# EAGLE design HydraLinCan (EAGLE 9.6.2)
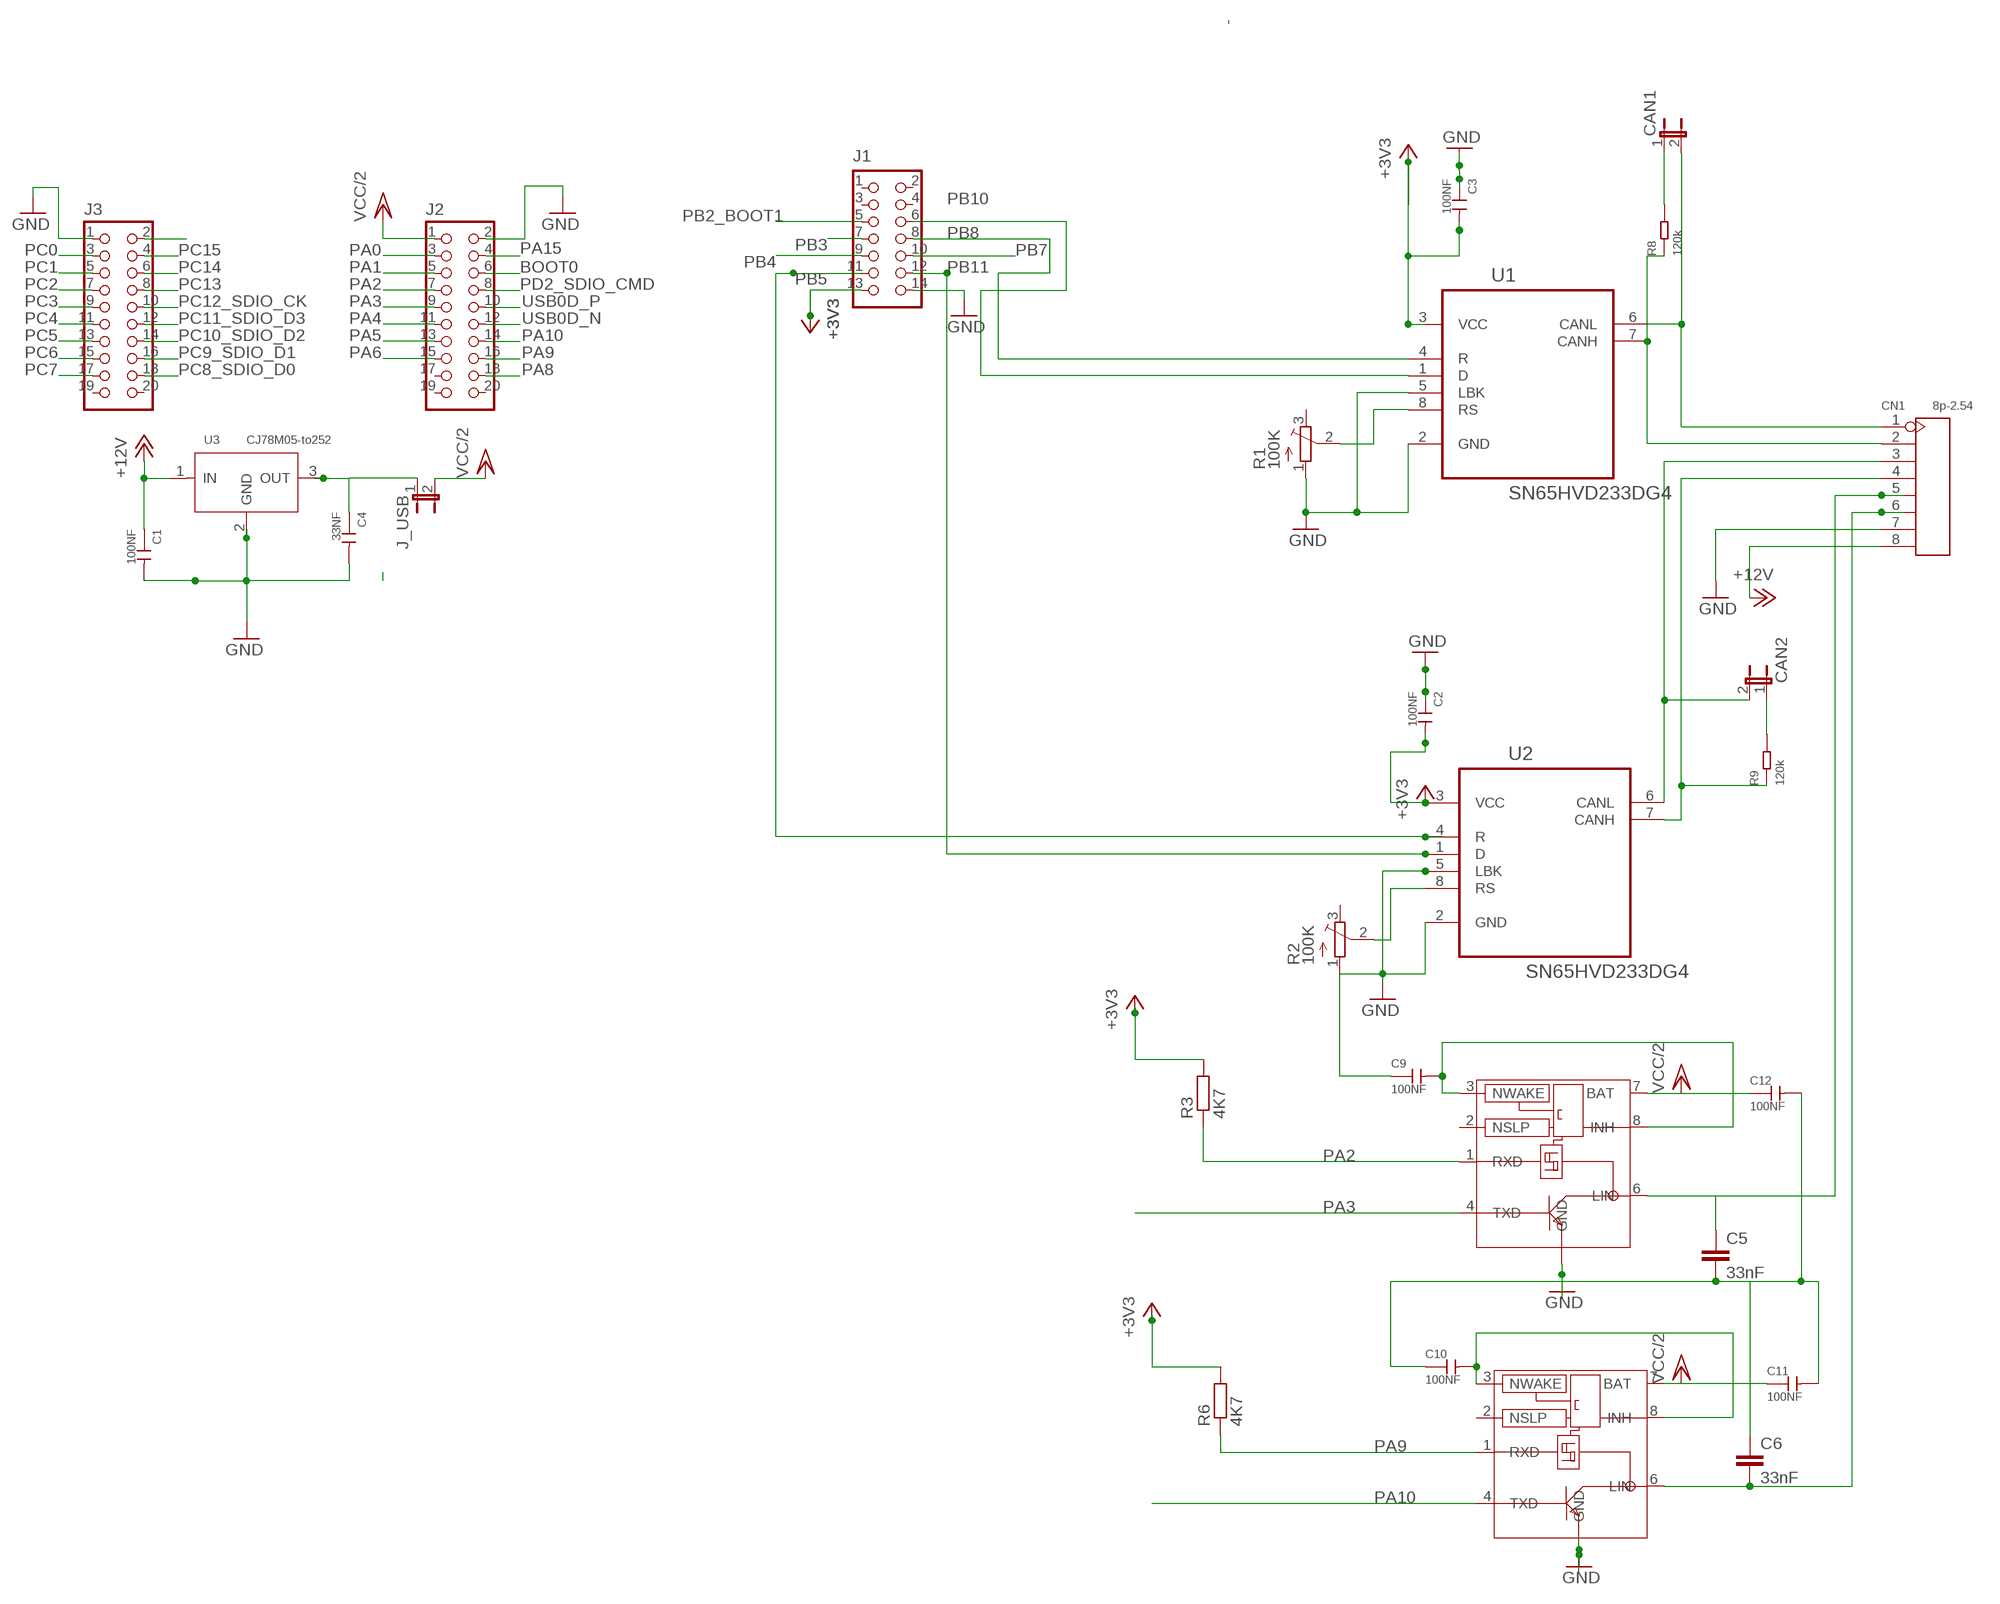
[diagram p0: schematic, sheet 1]

## Parts
C1  100NF  CERAMIC-100NF-50V-20%-Y5V(0805)  [C0805]
C2  100NF  CERAMIC-100NF-50V-20%-Y5V(0805)  [C0805]
C3  100NF  CERAMIC-100NF-50V-20%-Y5V(0805)  [C0805]
C4  33NF  CERAMIC-100NF-50V-20%-Y5V(0805)  [C0805]
C5  33nF  CAP1206  [1206]
C6  33nF  CAP1206  [1206]
C9  100NF  CERAMIC-100NF-50V-20%-Y5V(0805)  [C0805]
C10  100NF  CERAMIC-100NF-50V-20%-Y5V(0805)  [C0805]
C11  100NF  CERAMIC-100NF-50V-20%-Y5V(0805)  [C0805]
C12  100NF  CERAMIC-100NF-50V-20%-Y5V(0805)  [C0805]
CAN1  JP1E  [JP1]
CAN2  JP1E  [JP1]
CN1  8p-2.54  DIP-BLACK-FEMALE-HEADER-VERT(8P-2.54)  [H8-2.54]
J1  HYDRABUS_SHIELD_CON_HEADER_2X07  [HYDRABUS_SHIELD_M2X7]
J2  HYDRABUS_SHIELD_CON_HEADER_2X10  [HYDRABUS_SHIELD_M2X10]
J3  HYDRABUS_SHIELD_CON_HEADER_2X10  [HYDRABUS_SHIELD_M2X10]
J_USB  JP1E  [JP1]
LIN1  TJA1021SO8  TJA1020SO8  [SO8]
LIN2  TJA1021SO8  TJA1020SO8  [SO8]
R1  100K  TRIM_EU-SM-42/43A  [SM-42/43A]
R2  100K  TRIM_EU-SM-42/43A  [SM-42/43A]
R3  4K7  R-EU_M1206  [M1206]
R6  4K7  R-EU_M1206  [M1206]
R8  120k  SMD-RES-33K-1%-1/4W(1206)  [R1206]
R9  120k  SMD-RES-33K-1%-1/4W(1206)  [R1206]
U1  SN65HVD233DG4  [SOIC127P600X175-8N]
U2  SN65HVD233DG4  [SOIC127P600X175-8N]
U3  CJ78M05-to252  PMIC-CJ78M05(TO-252)  [TO-252]

## Nets
+3V3 [VDD]: C2.2 C3.2 J1.13 R3.2 R6.2 U1.3(VCC) U2.3(VCC)
+12V [VDD]: C1.1 CN1.8 U3.1(IN)
BOOT0: J2.6
CAN1_N [CAN1]: CAN1.2 CN1.1 U1.6(CANL)
CAN1_P [CAN1]: CN1.2 R8.1 U1.7(CANH)
CAN2_N [CAN]: CAN2.2 CN1.3 U2.6(CANL)
CAN2_P [CAN]: CN1.4 R9.1 U2.7(CANH)
GND [VDD]: C1.2 C2.1 C3.1 C4.2 C5.2 C6.1 C10.1 C11.2 C12.2 CN1.7 J1.14 J2.2 J3.1 LIN1.5(GND) LIN2.5(GND) R1.1(A) U1.2(GND) U1.5(LBK) U2.5(LBK) U3.2(GND)
N$1: R1.2(S) U1.8(RS)
N$4: C5.1 CN1.5 LIN1.6(LIN)
N$7: C6.2 CN1.6 LIN2.6(LIN)
N$9 [VDD]: C9.2 LIN1.3(NWAKE) LIN1.8(INH)
N$10 [VDD]: C10.2 LIN2.3(NWAKE) LIN2.8(INH)
N$13: C9.1 R2.1(A) U2.2(GND)
N$15 [VDD]: C4.1 J_USB.1 U3.3(OUT)
N$16: CAN2.1 R9.2
N$17: R2.2(S) U2.8(RS)
N$19: CAN1.1 R8.2
N$22 [POWER]: J3.2
PA0: J2.3
PA1: J2.5
PA2: J2.7 LIN1.1(RXD) R3.1
PA3: J2.9 LIN1.4(TXD)
PA4: J2.11
PA5: J2.13
PA6: J2.15
PA8: J2.18
PA9: J2.16 LIN2.1(RXD) R6.1
PA10: J2.14 LIN2.4(TXD)
PA15: J2.4
PB2_BOOT1: J1.5
PB3: J1.7
PB4: J1.9
PB5: J1.11 U2.4(R)
PB7: J1.10
PB8: J1.8 U1.4(R)
PB10: J1.6 U1.1(D)
PB11: J1.12 U2.1(D)
PC0: J3.3
PC1: J3.5
PC2: J3.7
PC3: J3.9
PC4: J3.11
PC5: J3.13
PC6: J3.15
PC7: J3.17
PC8_SDIO_D0: J3.18
PC9_SDIO_D1: J3.16
PC10_SDIO_D2: J3.14
PC11_SDIO_D3: J3.12
PC12_SDIO_CK: J3.10
PC13: J3.8
PC14: J3.6
PC15: J3.4
PD2_SDIO_CMD: J2.8
USB0D_N: J2.12
USB0D_P: J2.10
VCC/2 [VDD]: C11.1 C12.1 J2.1 J_USB.2 LIN1.7(BAT) LIN2.7(BAT)
Unconnected: J1.1 J1.2 J1.3 J1.4 J2.17 J2.19 J2.20 J3.19 J3.20 LIN1.2(NSLP) LIN2.2(NSLP) R1.3(E) R2.3(E)

## Library data of the parts
C1-C3 C9-C12 = Seeed-OPL-Capacitor:CERAMIC-100NF-50V-20%-Y5V(0805): 302010145
C4 = Seeed-OPL-Capacitor:CERAMIC-100NF-50V-20%-Y5V(0805): 302010145; VALUE: 100NF
C5 C6 = _c2h:CAP: Capacitor Standard 0603 ceramic capacitor, and 0.1" leaded capacitor.
CAN1 CAN2 J_USB = jumper:JP1E: JUMPER
CN1 = Seeed-OPL-Connector:DIP-BLACK-FEMALE-HEADER-VERT(8P-2.54): 320030061; MPN: F185-1108A1BSYC1
J1 = hydrabus_shield:HYDRABUS_SHIELD_CON_HEADER_2X07: 2x7 Pin header
J2 J3 = hydrabus_shield:HYDRABUS_SHIELD_CON_HEADER_2X10: 2x10 Pin header
LIN1 LIN2 = nxp:TJA1020: Lin Transiver Vbat 5...27Volt 3,3Volt support no extra supply needed ->www.lin-subbus.org ->www.semiconductor.philips.com/pip/tja1020t
R1 R2 = pot:TRIM_EU-: POTENTIOMETER
R3 R6 = resistor:R-EU_: RESISTOR, European symbol
R8 R9 = Seeed-OPL-Resistor:SMD-RES-33K-1%-1/4W(1206): 301010725; MPN: RC1206FR-0733KL; VALUE: 33k
U1 U2 = Texas Instruments_By_element14_Batch_1:SN65HVD233DG4: CAN TRANSCEIVERS; MPN: SN65HVD233DG4; OC_FARNELL: 1207268; OC_NEWARK: 16M2304; PACKAGE: SOIC-8; SUPPLIER: TI
U3 = Seeed-OPL-ic:PMIC-CJ78M05(TO-252): 310030100; MPN: CJ78M05

## Net classes
0 default: width 0.254 mm, drill 0.33 mm, clearance 0.203 mm
1 POWER: width 0.33 mm, drill 0.33 mm, clearance 0.203 mm
2 VDD: width 0.33 mm, drill 0.33 mm, clearance 0.203 mm
3 CAN: width 0.33 mm, drill 0.33 mm, clearance 0.203 mm
4 CAN1: width 0.33 mm, drill 0.33 mm, clearance 0.203 mm

## Board
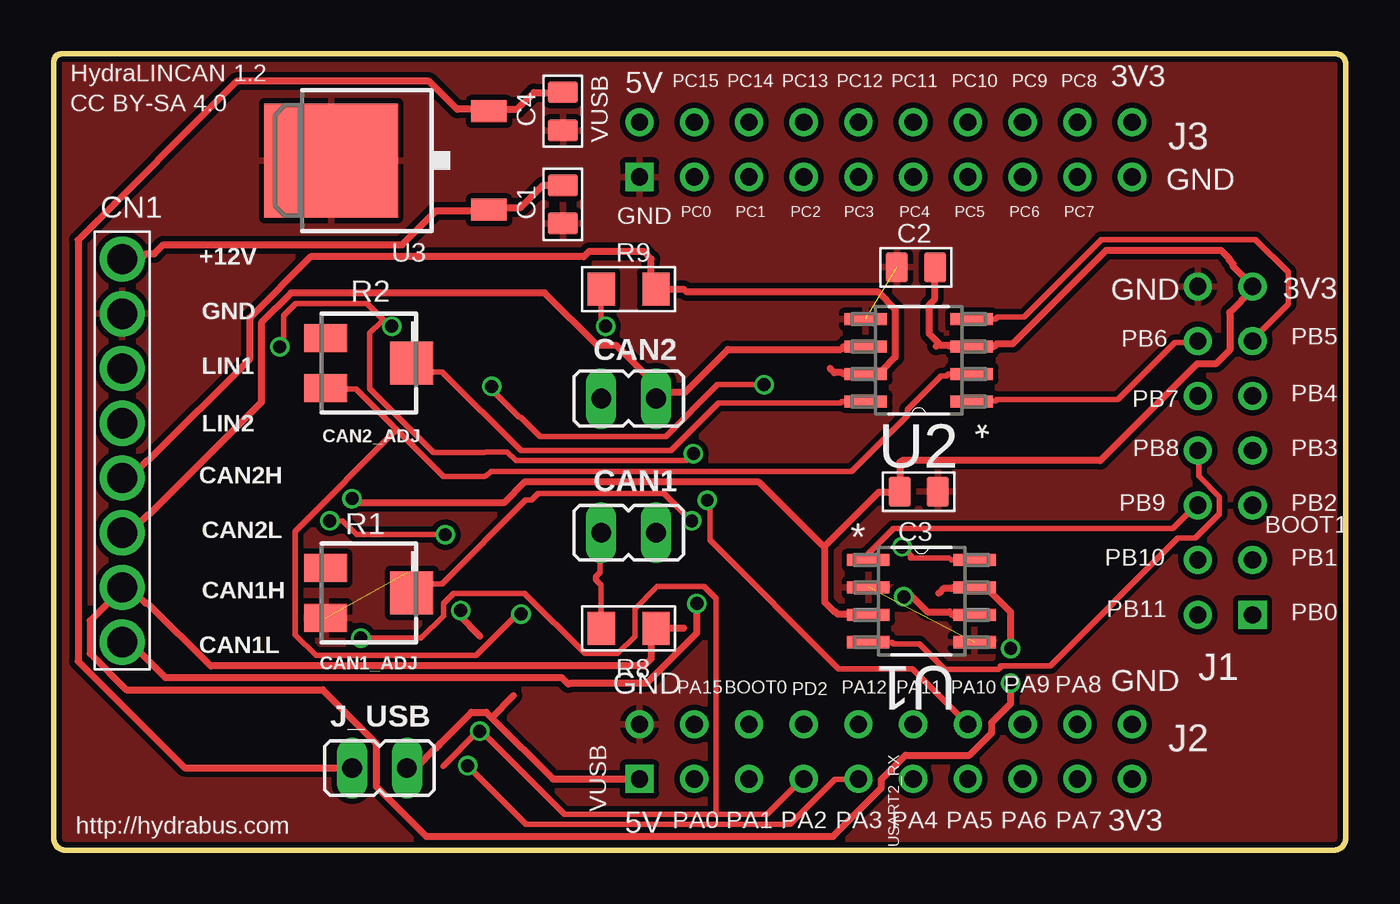
[diagram p1: board, top side]
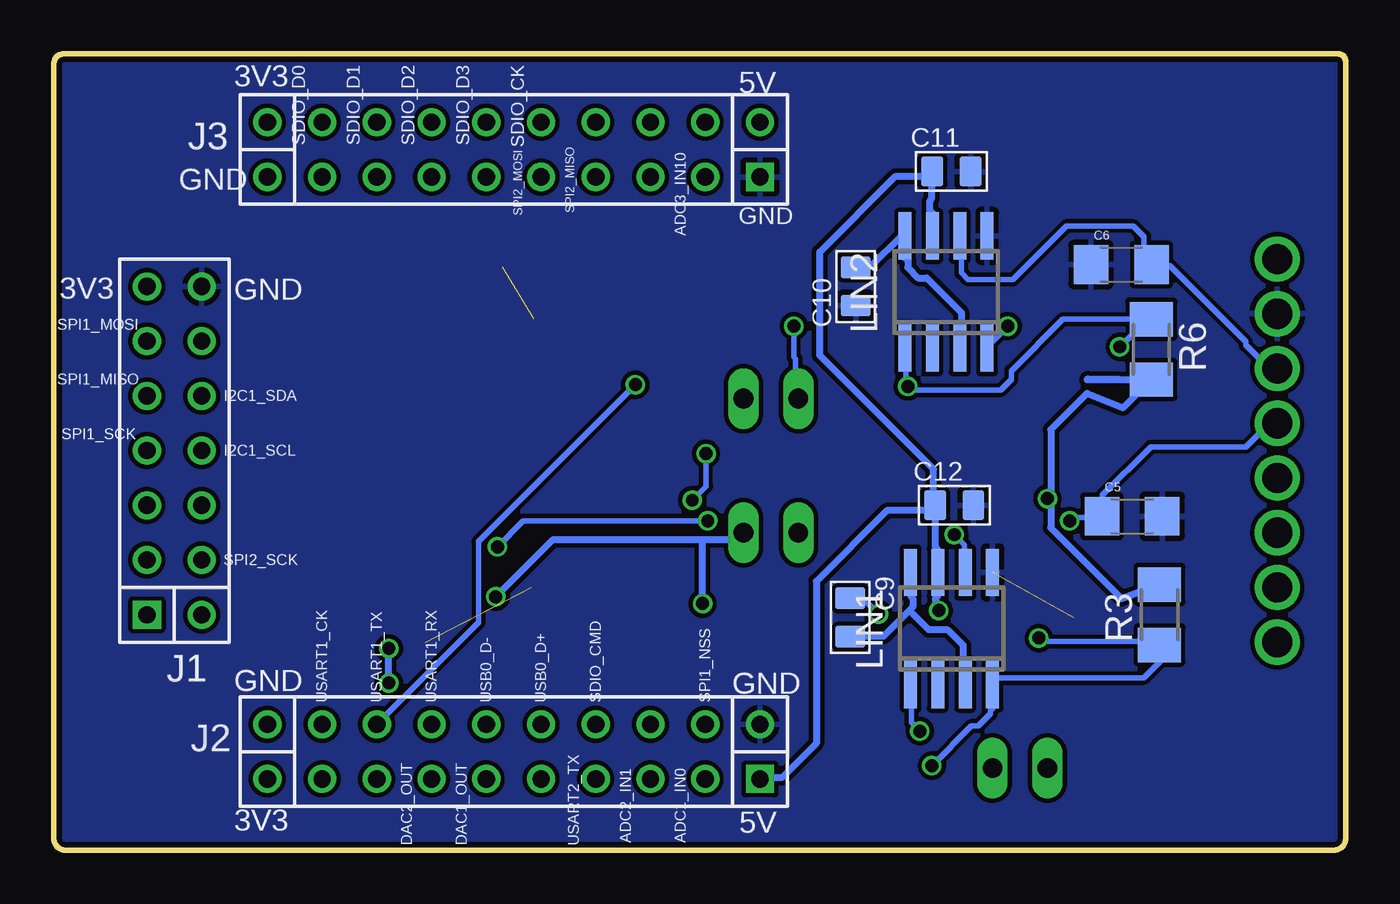
[diagram p2: board, bottom side, seen from below]

Size 59.94 x 36.96 mm. Coordinates in mm from the lower left corner, seen from the top.
Outline: 59.41,0 0.52,0 arc-90 0,0.52 0,36.6 arc-90 0.36,36.96 59.49,36.96 arc-90 59.94,36.5 59.94,0.54 arc-90 59.41,0
Copper layers (1*16): Top 0.035mm / dielectric 1.5mm / Bottom 0.035mm
Design rules "SeeedStudio_2layer_DRU_no_angle_20140221 *": minimum track width 6mil, minimum drill 0.6mm, track to track 6mil, track to pad 6mil, pad to pad 6mil, via to via 6mil, smd to smd 0mil, copper to edge 10mil, drill to drill 10mil, minimum pad ring 10mil, minimum via ring 6mil, stop-mask expansion 2mil, vias tented up to drill 100mil, thermal gap 10mil

### Footprints (pad centres in the part's own frame; a part is rotated, then mirrored left to right if it is on the bottom)
C0805 = smd 1.397 x 1.016: 1 0,0.889; 2 0,-0.889
1206 = smd 1.6 x 1.8: 1 -1.4,0; 2 1.4,0
JP1 = drill 0.914 long: 1 0,-1.27; 2 0,1.27
H8-2.54 = drill 1.4 pad 1.93: 1 0,8.89; 2 0,6.35; 3 0,3.81; 4 0,1.27; 5 0,-1.27; 6 0,-3.81; 7 0,-6.35; 8 0,-8.89
HYDRABUS_SHIELD_M2X7 = drill 0.8 square: 1 -7.62,-1.27 | drill 0.8: 2 -7.62,1.27; 3 -5.08,-1.27; 4 -5.08,1.27; 5 -2.54,-1.27; 6 -2.54,1.27; 7 0,-1.27; 8 0,1.27; 9 2.54,-1.27; 10 2.54,1.27; 11 5.08,-1.27; 12 5.08,1.27; 13 7.62,-1.27; 14 7.62,1.27
HYDRABUS_SHIELD_M2X10 = drill 0.8 square: 1 -11.43,-1.27 | drill 0.8: 2 -11.43,1.27; 3 -8.89,-1.27; 4 -8.89,1.27; 5 -6.35,-1.27; 6 -6.35,1.27; 7 -3.81,-1.27; 8 -3.81,1.27; 9 -1.27,-1.27; 10 -1.27,1.27; 11 1.27,-1.27; 12 1.27,1.27; 13 3.81,-1.27; 14 3.81,1.27; 15 6.35,-1.27; 16 6.35,1.27; 17 8.89,-1.27; 18 8.89,1.27; 19 11.43,-1.27; 20 11.43,1.27
SO8 = smd 0.6 x 2.2: 1 -1.905,-2.6; 2 -0.635,-2.6; 3 0.635,-2.6; 4 1.905,-2.6; 5 1.905,2.6; 6 0.635,2.6; 7 -0.635,2.6; 8 -1.905,2.6
SM-42/43A = smd 2 x 1.3: 1 2,1.15; 3 2,-1.15 | smd 2 x 2: 2 -2,0
M1206 = smd 1.6 x 2: 1 -1.4,0; 2 1.4,0
R1206 = smd 1.27 x 1.524: 1 -1.27,0; 2 1.27,0
SOIC127P600X175-8N = smd 1.981 x 0.559: 1 -2.464,1.905; 2 -2.464,0.635; 3 -2.464,-0.635; 4 -2.464,-1.905; 5 2.464,-1.905; 6 2.464,-0.635; 7 2.464,0.635; 8 2.464,1.905
TO-252 = smd 1.016 x 1.651: 1 -2.286,-4.826; 3 2.286,-4.826 | smd 5.3 x 6.2: 2 0,2.5

### Placement (x,y rotation side)
C1  23.62,29.97 0 top
C2  40.01,27.05 90 top
C3  40.13,16.64 270 top
C4  23.62,34.29 0 top
C5  9.91,15.49 0 bottom
C6  10.41,27.18 0 bottom
C9  22.99,10.79 0 bottom
C10  22.73,26.16 180 bottom
C11  18.29,31.5 90 bottom
C12  18.16,16 90 bottom
CAN1  26.67,14.73 270 top
CAN2  26.67,20.95 270 top
CN1  3.17,18.54 180 top
J1  54.36,18.54 90 top
J2  38.61,4.57 0 top
J3  38.61,32.51 0 top
J_USB  15.11,3.81 270 top
LIN1  18.29,10.29 0 bottom
LIN2  18.54,25.91 0 bottom
R1  14.61,11.94 180 top
R2  14.61,22.61 180 top
R3  8.64,10.92 90 bottom
R6  9.02,23.24 270 bottom
R8  26.67,10.29 180 top
R9  26.67,26.04 180 top
U1  40.26,11.56 0 top
U2  40.13,22.73 180 top
U3  15.37,32 90 top

### Tracks (layer width: path | path; a pad name or v marks a point on that pad's centre or on a via)
+3V3  (via drill 0.6)
  Top 0.33: 35.78,14.12 38.28,16.62 39.24,16.62 C3.2 39.26,16.8 39.26,18 39.36,18.08 48.56,18.08 53.04,22.56 53.92,22.56 54.56,23.2 54.56,24.96 55.6,26 J1.13 55.62,26.18 55.3,26.5 55.3,26.52 54.72,27.1 54.72,27.22 54.54,27.4 54.54,27.46 54.16,27.84 48.84,27.84 44.5,23.5 43.76,23.5 43.64,23.38 42.76,23.38 U2.3 42.58,23.38 41.58,23.38 41.54,23.42 41.16,23.42 41.07,23.51 | 35.78,14.12 35.78,11.5 36.22,11.06 36.26,11.06 36.38,10.94 37.78,10.94 U1.3 | 41.07,23.51 40.62,23.96 40.62,25.32 40.88,25.58 C2.2 | 40.94,23.38 41.07,23.51 | 35.78,14.12 35.62,14.18 32.72,17.08 21.84,17.08 20.88,16.12 13.78,16.12 13.68,16.24 13.76,16.32 v13.84,16.32
  Bottom 0.33: 8.4,12.48 8.54,12.42 R3.2 10.4,11.68 13.68,14.96 13.68,16.32 | 9.04,21.84 12,21.84 11.95,21.89 R6.2 10.33,20.53 12,21.2 13.68,19.52 13.68,16.32 | v13.84,16.32 13.68,16.32
+12V
  Top 0.33: C1.1 22.7,30.86 21.66,29.82 20.3,29.82 U3.1 20.04,29.68 17.74,29.68 16.16,28.1 5.08,28.1 4.66,27.68 4.28,27.68 4.04,27.44 CN1.8
CAN1_N  (via drill 0.6)
  Top 0.33: U1.6 41.7,10.92 41.56,11.06 40.54,11.06 39.78,11.82 39.68,11.76 v39.44,11.76 | CN1.1 3.54,9.64 5.18,8 23.58,8 23.88,7.7 24,7.76 27.52,7.76 29.84,10.08 v29.84,11.44
  Bottom 0.33: v39.44,11.76 36.8,14.4 29.84,14.4 | 29.84,14.4 28.32,14.4 28,14.72 CAN1.2 | v29.84,11.44 29.84,14.4
CAN1_P  (via drill 0.6)
  Top 0.33: 29.24,10.3 R8.1 27.86,10.14 27.72,10 27.72,8.88 27.38,8.54 7.28,8.54 4.36,11.46 4.26,11.46 3.54,12.18 CN1.2 3.12,12.08 1.68,10.64 1.68,9.12 3.36,7.44 12.48,7.44 14.96,4.96 14.96,2.96 17.28,0.64 36.16,0.64 38.4,2.88 38.4,3.28 39.52,4.4 42.48,4.4 43.52,5.44 43.52,5.92 44.4,6.8 v44.4,7.76 | 41.06,11.92 41.28,12.14 41.66,12.14 41.7,12.18 U1.7 42.88,12.16 43.28,12.16 44.4,11.04 v44.4,9.36
  Bottom 0.33: v44.4,7.76 v44.4,9.36
CAN2_N
  Top 0.33: U2.6 36.64,23.36 36.52,23.24 31.28,23.24 29.3,21.26 28.24,21.26 CAN2.2 28.14,21.38 26.1,23.42 25.22,23.42 22.78,25.86 11,25.86 9.62,24.48 9.62,20.78 4.4,15.56 4.36,15.56 3.54,14.74 CN1.3
CAN2_P
  Top 0.33: 36.02,22.36 36.22,22.16 36.58,22.16 36.64,22.1 U2.7 37.76,22.24 38.4,22.24 39.04,22.88 39.04,25.12 38.24,25.92 29.36,25.92 29.24,26.02 27.94,26.02 R9.1 27.88,26.2 27.72,26.36 27.72,27.44 27.38,27.78 24.84,27.78 24.6,27.54 11.92,27.54 9.08,24.7 9.08,22.78 4.4,18.1 4.36,18.1 3.54,17.28 CN1.4
GND  (3 unrouted)
  pour Top (isolate 0.254): -1,38.22 60.84,38.22 60.84,-1 -1,-1
  pour Bottom (isolate 0.203): -2.02,39.86 62.13,39.86 62,-2 -2,-2
N$1  (via drill 0.6)
  Top 0.254: 39.74,13.56 39.76,13.56 | 39.76,13.56 41.54,13.56 41.64,13.46 U1.8 | R1.2 17.04,12.36 18.02,12.36 21.9,16.24 22.18,16.24 22.24,16.32 22.48,16.56 28.32,16.56 v29.6,15.28 | v39.36,14.08 39.76,13.68 39.76,13.56
  Bottom 0.254: v39.36,14.08 38.16,15.28 v29.6,15.28
N$4  (via drill 0.6)
  Top 0.254: v18.16,14.64 14.04,14.64 13.4,15.28 v12.8,15.28 12.78,15.28
  Bottom 0.254: v12.8,15.28 12.64,15.44 11.36,15.44 C5.1 11.28,15.6 11.28,16.48 9.04,18.72 4.64,18.72 3.6,19.76 3.2,19.76 CN1.5 | v18.16,14.64 17.68,14.16 17.68,12.96 LIN1.6
N$7
  Bottom 0.254: CN1.6 3.2,22.4 3.6,22.4 4.64,23.44 4.64,23.6 8.16,27.12 8.96,27.12 C6.2 9.04,27.28 9.36,27.6 9.36,28.48 9.84,28.96 12.96,28.96 15.44,26.48 17.52,26.48 17.84,26.8 17.84,28.48 LIN2.6
N$9
  Bottom 0.33: 20.24,11.12 20.08,11.28 20.08,11.68 20.16,11.76 20.16,12.88 LIN1.8 | 20.24,11.12 21.44,9.92 22.96,9.92 C9.2 | 20.24,11.12 19.36,10.24 18.48,10.24 17.76,9.52 17.76,8.96 17.68,8.88 17.68,7.76 LIN1.3
N$10
  Bottom 0.33: C10.2 22.72,27.12 22,27.12 20.64,28.48 20.48,28.48 LIN2.8 20.48,28.32 20.48,27.52 20.32,27.36 20.32,27.04 19.84,26.56 19.44,26.56 17.84,24.96 17.84,23.36 LIN2.3
N$13  (via drill 0.6)
  Top 0.254: 15.91,19.51 14.02,21.4 12.66,21.4 12.62,21.44 R2.1 | 15.91,19.51 18.08,17.34 19.96,17.34 20.08,17.38 20.28,17.58 37.02,17.58 39.6,20.16 39.6,20.44 41.16,22 41.42,22 41.52,22.1 42.58,22.1 U2.2 | v21.68,10.96 21.52,10.96 19.6,9.04 12.16,9.04 11.2,10 11.2,14.8 15.91,19.51
  Bottom 0.254: v21.68,10.96 22.4,11.68 22.96,11.68 C9.1
N$15
  Top 0.33: C4.1 23.62,35.16 22.28,35.16 21.5,34.38 20.28,34.38 U3.3 20.06,34.38 18.72,34.38 17.42,35.68 8.48,35.68 1.12,28.32 1.12,8.76 6.06,3.82 J_USB.1
N$16  (via drill 0.6)
  Top 0.254: R9.2 25.4,24.6 25.44,24.48 v25.6,24.32
  Bottom 0.254: v25.6,24.32 25.6,22.88 25.52,22.8 25.52,21.04 25.44,20.96 CAN2.1
N$17
  Top 0.254: U2.8 36.58,20.82 36.5,20.74 30.84,20.74 28.64,18.54 21.68,18.54 18.02,22.2 17.02,22.2 R2.2
N$19
  Top 0.254: R8.2 25.4,12.3 25.14,12.56 25.14,12.68 25.34,12.88 25.34,13.36 25.4,13.42 CAN1.1
PA2  (via drill 0.6)
  Top 0.254: 19.72,5.56 18.06,3.9 | 30.72,1.66 23.7,1.66 19.84,5.52 19.72,5.56 | 30.72,1.66 33.1,1.66 34.74,3.3 34.78,3.3 J2.7 | v14.24,9.84 17.04,9.84 18.08,10.88 18.08,11.44 18.56,11.92 21.84,11.92 24.64,9.12 26.16,9.12 26.96,9.92 26.96,11.2 28,12.24 30.16,12.24 30.72,11.68 30.72,1.66 | v19.76,5.52 19.72,5.56
  Bottom 0.254: v14.24,9.84 14.08,9.68 8.69,9.68 R3.1 | v19.76,5.52 20.16,5.92 20.16,7.68 LIN1.1
PA3  (via drill 0.6)
  Top 0.254: v19.2,3.92 21.92,1.2 34.16,1.2 36.24,3.28 37.28,3.28 J2.9
  Bottom 0.254: 8.4,9.6 8.4,8.96 9.36,8 16.16,8 16.4,7.76 LIN1.4 16.32,7.6 16.32,6.64 16.48,6.48 16.48,6.32 17.04,5.76 17.36,5.76 v19.2,3.92
PA9  (via drill 0.6)
  Top 0.254: 20.14,21.54 20.24,21.44 | 20.24,21.44 21.58,20.1 21.68,20.08 22.56,19.2 28.4,19.2 30.8,21.6 v32.96,21.6 | v20.32,21.52 20.24,21.44
  Bottom 0.254: LIN2.1 20.4,23.28 20.4,21.6 v20.32,21.52 20.16,21.36 16,21.36 15.52,21.84 15.52,22.24 13.12,24.64 9.03,24.64 R6.1 | J2.16 40.24,10.56 40.24,14.32 v32.96,21.6
PA10  (via drill 0.6)
  Top 0.254: v10.49,23.35 10.66,23.52 10.66,24.8 11.22,25.36 14.54,25.36 15.34,24.56 | v10.49,23.35 10.46,23.32 | J2.14 39.84,8.42 36.42,8.42 30.44,14.4 30.44,16.24 v30.32,16.24 | 15.34,24.56 15.2,24.54 14.66,24 14.66,21.42 17.62,18.46 19.96,18.46 20.08,18.48 21.04,18.48 21.44,18.08 29.36,18.08 v29.68,18.4 | v10.48,23.36 v10.49,23.35 | v15.68,24.32 15.44,24.56 15.34,24.56
  Bottom 0.254: 9.04,24.64 9.2,24.64 v10.48,23.36 | v15.68,24.32 16.56,23.44 16.56,23.36 LIN2.4 | v29.68,18.4 29.68,16.88 v30.32,16.24
PB5
  Top 0.254: U2.4 43.68,24.64 43.78,24.74 45.02,24.74 48.62,28.34 55.76,28.34 57.28,26.82 57.28,25.34 55.64,23.7 55.64,23.64 J1.11
PB8
  Top 0.254: U1.4 38.88,9.64 38.96,9.56 40.16,9.56 41.34,8.38 43.84,8.38 43.92,8.46 43.92,8.56 46.24,8.56 52.16,14.48 52.96,14.48 54.08,15.6 54.08,16.4 53.12,17.36 53.12,18.48 J1.8
PB10
  Top 0.254: U1.1 37.8,13.48 37.8,13.76 38.96,14.92 51.92,14.92 53,16 J1.6
PB11
  Top 0.254: U2.1 43.68,20.84 43.76,20.92 49.38,20.92 52.02,23.56 53.02,23.56 J1.12
VCC/2  (via drill 0.6)
  Top 0.33: 20.31,6.15 20.06,6.4 19.38,6.4 17.92,4.94 17.92,4.92 17.74,4.74 17.72,4.74 16.8,3.82 16.4,3.82 J_USB.2 | 20.31,6.15 23.16,3.3 27.16,3.3 J2.1 | 21.32,7.16 20.31,6.15 | 18.58,11.12 18.77,10.93 | 18.77,10.93 19.76,9.94 | v18.88,11.12 18.88,11.04 18.77,10.93
  Bottom 0.33: LIN2.7 19.12,28.56 19.12,29.52 19.28,29.68 19.28,30.16 19.2,30.24 19.2,31.44 C11.1 19.36,31.28 20.88,31.28 24.4,27.76 24.4,22.96 19.12,17.68 19.12,16.08 C12.1 | v18.88,11.12 19.04,11.28 19.04,11.68 18.96,11.76 18.96,12.88 LIN1.7 18.96,13.04 18.96,14 19.04,14.08 C12.1 | J2.1 27.12,3.36 26.16,3.36 24.56,4.96 24.56,12.48 21.28,15.76 19.2,15.76 C12.1

### Text on the board
tPlace: +12V | GND | LIN1 | LIN2 | CAN2_ADJ | CAN2H | CAN2L | CAN1H | CAN1L | CAN1_ADJ
tNames: HydraLINCAN 1.2 | 5V | PC15 | PC14 | PC13 | PC12 | PC11 | PC10 | PC9 | PC8 | 3V3 | CC BY-SA 4.0 | VUSB | J3 | GND | GND | PC0 | PC1 | PC2 | PC3 | PC4 | PC5 | PC6 | PC7 | GND | 3V3 | PB6 | PB5 | PB7 | PB4 | PB8 | PB3 | PB9 | PB2 | BOOT1 | PB10 | PB1 | PB11 | PB0 | PA15 | BOOT0 | PD2 | PA12 | PA11 | PA10 | PA9 | PA8 | J1 | GND | GND | J2 | USART2_RX | VUSB | http://hydrabus.com | 5V | PA0 | PA1 | PA2 | PA3 | PA4 | PA5 | PA6 | PA7 | 3V3
bNames: SDIO_CK | SDIO_D3 | SDIO_D2 | SDIO_D1 | SDIO_D0 | 5V | 3V3 | SPI2_MISO | SPI2_MOSI | ADC3_IN10 | GND | GND | GND | 3V3 | SPI1_MOSI | SPI1_MISO | I2C1_SDA | SPI1_SCK | I2C1_SCL | SPI2_SCK | GND | SPI1_NSS | SDIO_CMD | USB0_D+ | USB0_D- | USART1_RX | USART1_TX | USART1_CK | GND | ADC1_IN0 | ADC2_IN1 | USART2_TX | DAC1_OUT | DAC2_OUT | 5V | 3V3